# EAGLE design LNA-N (EAGLE 7.2.0)
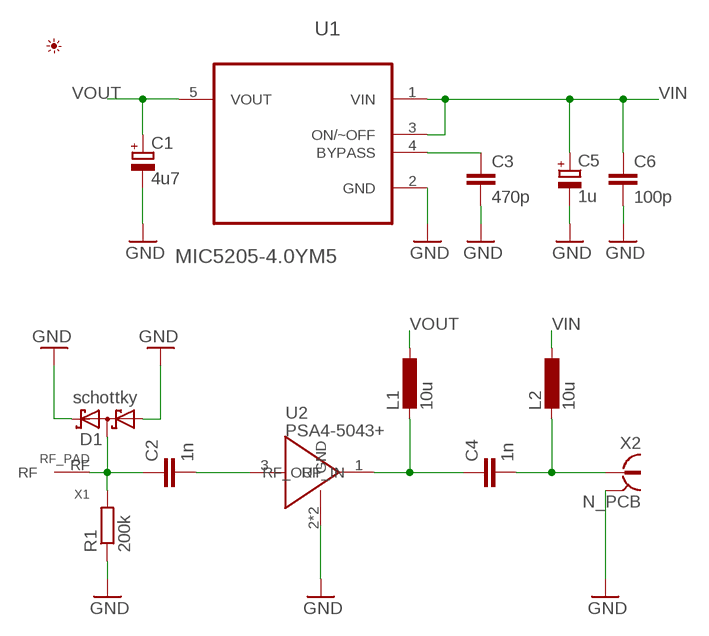
[diagram p0: schematic, sheet 1]

## Parts
C1  4u7  CPOL-EUSMCA  [SMC_A]
C2  1n  C-EUC0805  [C0805]
C3  470p  C-EUC0603  [C0603]
C4  1n  C-EUC0805  [C0805]
C5  1u  CPOL-EUSMCA  [SMC_A]
C6  100p  C-EUC0603  [C0603]
D1  schottky  BAS70-04  [SOT23]
L1  10u  L-EUL2012C  [L2012C]
L2  10u  L-EUL2012C  [L2012C]
R1  200k  R-EU_R0805  [R0805]
U1  MIC5205-4.0YM5  LP2985A-18DBVJ  [SOT95P280X145-5N]
U2  PSA4-5043+  [SOT343]
U$1  PICTO_1  [PICTO_1]
X1  RF_PAD  [RF_PAD]
X2  N_PCB  [N_PCB]

## Nets
GND: C1.- C3.2 C5.- C6.2 D1.1(A1) D1.2(C2) R1.1 U1.2(GND) U2.2(GND) U2.4(GND) X2.2 X2.3 X2.4 X2.5
N$1 [net]: C3.1 U1.4(BYPASS)
N$2 [RF]: C2.2 U2.3(RF_IN)
N$3 [RF]: C4.1 L1.2 U2.1(RF_OUT)
RF_IN [RF]: C2.1 D1.3(C1A2) R1.2 X1.RF
RF_OUT [RF]: C4.2 L2.2 X2.1
VIN [net]: C5.+ C6.1 L2.1 U1.1(VIN) U1.3(ON/~OFF)
VOUT [net]: C1.+ L1.1 U1.5(VOUT)

## Library data of the parts
C1 C5 = rcl:CPOL-EU: POLARIZED CAPACITOR, European symbol
C2-C4 C6 = rcl:C-EU: CAPACITOR, European symbol
D1 = diode:BAS70-04: Silicon Schottky Diodes General-purpose diode for high-speed switching
L1 L2 = rcl:L-EU: INDUCTOR, European symbol
R1 = rcl:R-EU_: RESISTOR, European symbol
U1 = Texas Instruments_By_element14_Batch_1:LP2985A-18DBVJ: 150-mA LOW-NOISE LOW-DROPOUT REGULATOR; MPN: LP2985A-18DBVJ; OC_FARNELL: 1924808; OC_NEWARK: 58T1987; PACKAGE: SOT-23-5; SUPPLIER: Texas Instruments
U2 = Mini-Circuits:PSA4-5043+: Mini-Circuits PSA4-5043+
U$1 = My_Picto:PICTO_1: Zdenek Brichacek; OK3ZB; http://blog.brichacek.net
X1 = RF coax:RF_PAD
X2 = RF coax:N_PCB: N Jack; OC_FARNELL: unknown; OC_NEWARK: unknown

## Net classes
1 RF: width 2.5 mm, clearance 0.508 mm
2 net: width 0.6 mm, clearance 0.254 mm

## Board
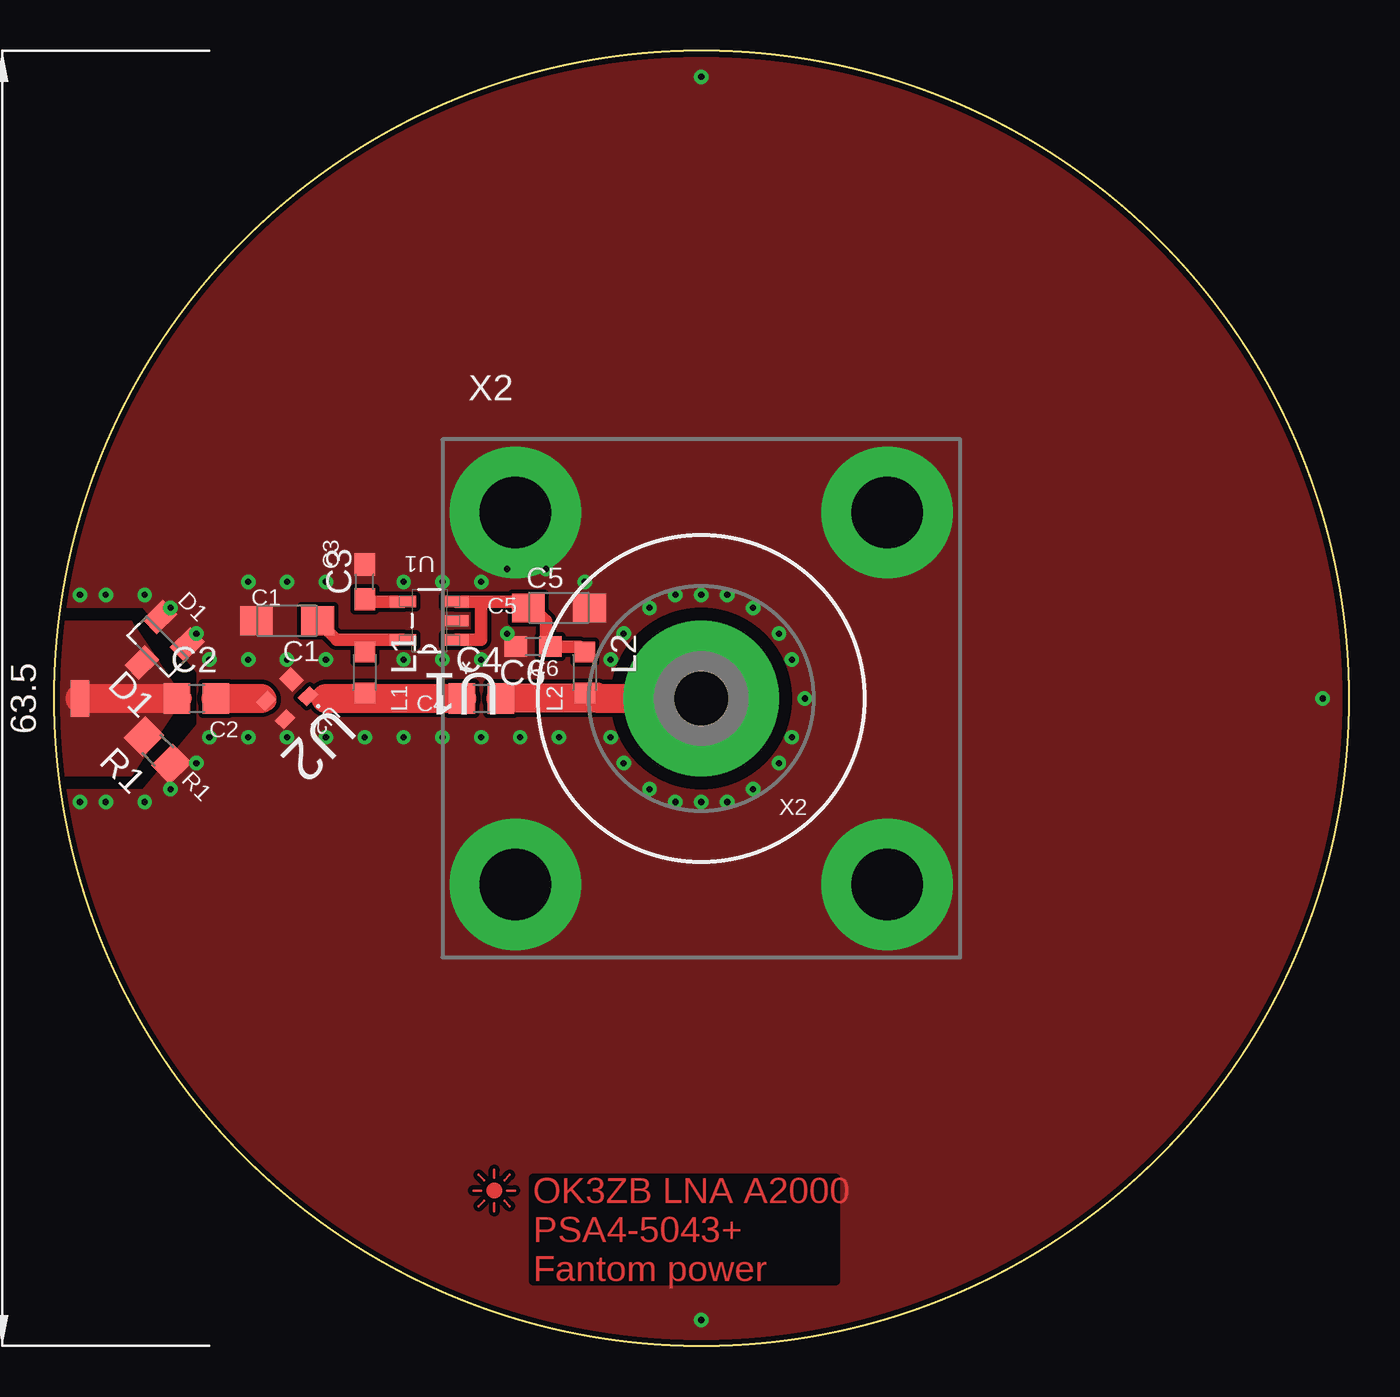
[diagram p1: board, top side]
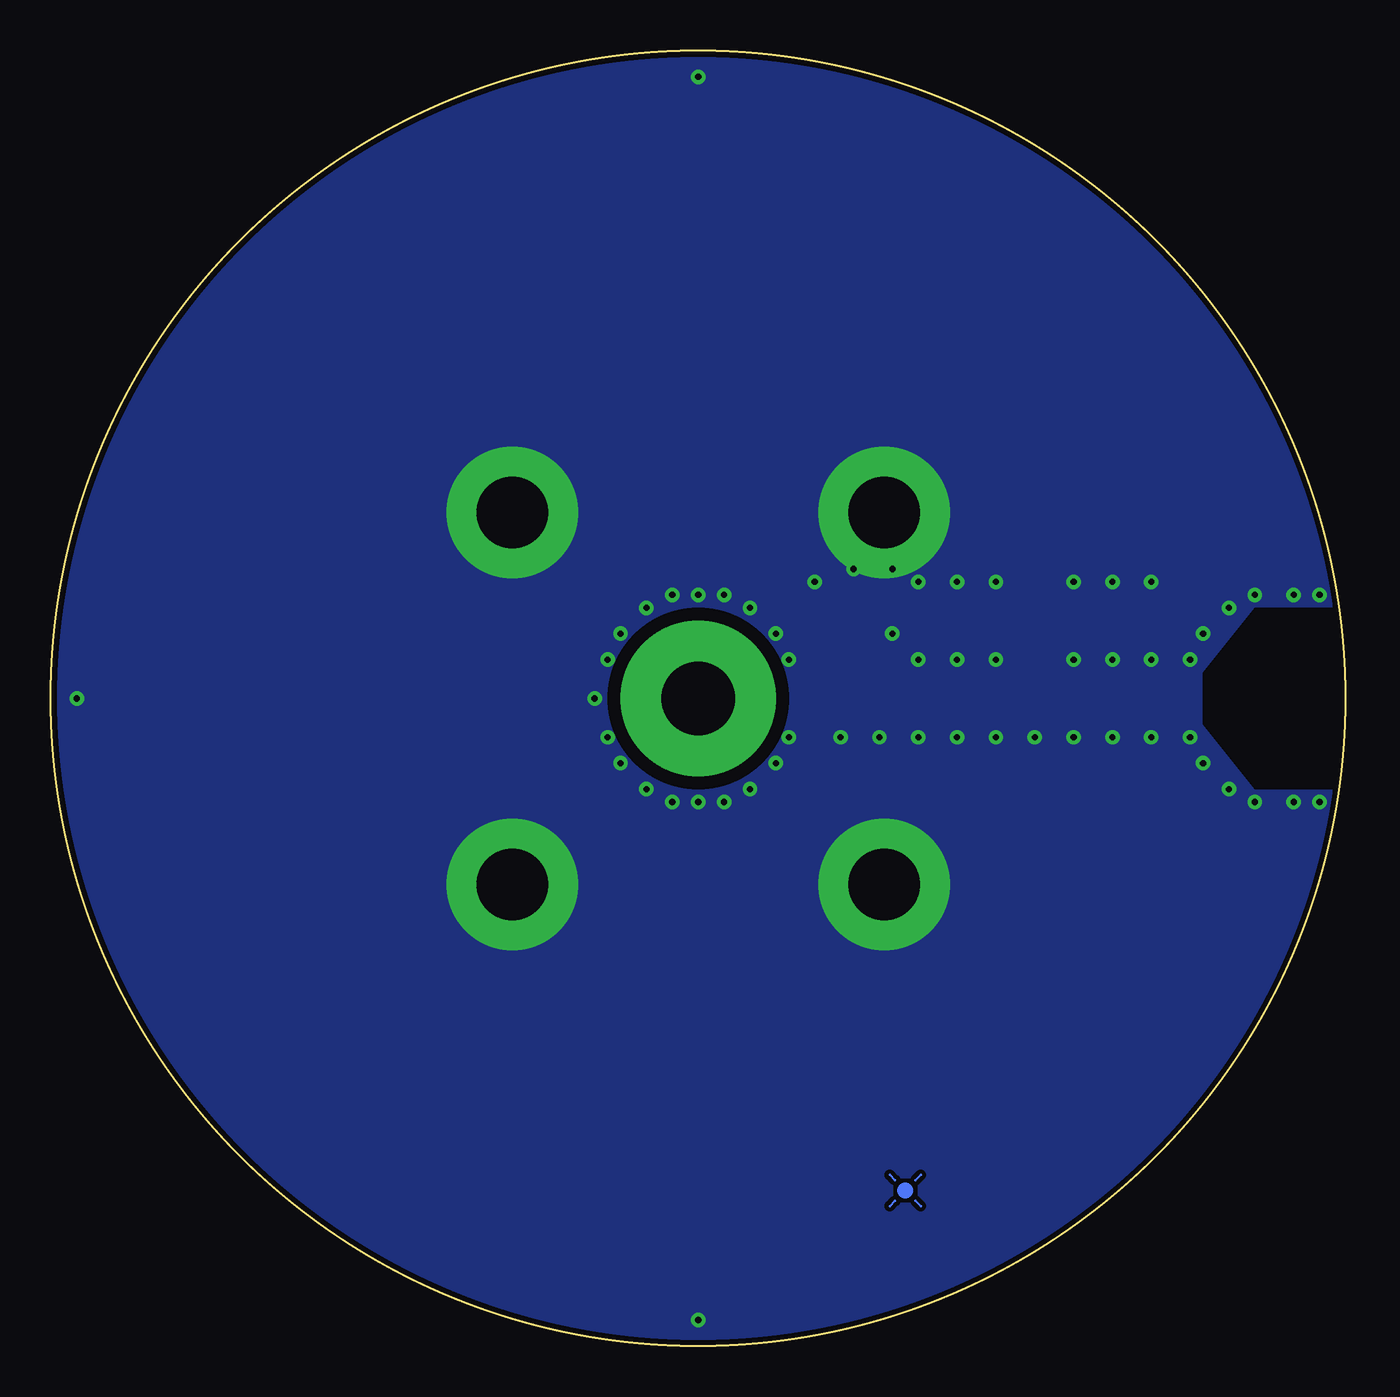
[diagram p2: board, bottom side, seen from below]

Size 63.5 x 63.5 mm. Coordinates in mm from the lower left corner, seen from the top.
Outline: circle at 31.75,31.75 radius 31.75
Copper layers (1*16): Top 0.035mm / dielectric 1.5mm / Bottom 0.035mm
Design rules "default *": minimum track width 10mil, minimum drill 24mil, track to track 8mil, track to pad 8mil, pad to pad 8mil, via to via 8mil, smd to smd 8mil, copper to edge 10mil, drill to drill 8mil, minimum pad ring 10mil, minimum via ring 8mil, stop-mask expansion 4mil, vias tented up to drill 0mil, thermal gap 0mil

### Footprints (pad centres in the part's own frame; a part is rotated, then mirrored left to right if it is on the bottom)
SMC_A = smd 1.6 x 1.4: + -1.5,0; - 1.5,0
C0805 = smd 1.3 x 1.5: 1 -0.95,0; 2 0.95,0
C0603 = smd 1.1 x 1: 1 -0.85,0; 2 0.85,0
SOT23 = smd 1 x 1.4: 1 -0.95,-1.1; 2 0.95,-1.1; 3 0,1.1
L2012C = smd 1 x 1: 1 -1,0; 2 1,0
R0805 = smd 1.3 x 1.5: 1 -0.95,0; 2 0.95,0
SOT95P280X145-5N = smd 1.27 x 0.559: 1 -1.295,0.94; 2 -1.295,0; 3 -1.295,-0.94; 4 1.295,-0.94; 5 1.295,0.94
SOT343 = smd 0.8 x 0.6: 1 -0.8,0.65; 3 0.8,-0.65; 4 0.8,0.65 | smd 0.8 x 0.9: 2 -0.8,-0.5
RF_PAD = smd 1.778 x 0.914: RF 0,0
N_PCB = drill 3.6 pad 7.62: 1 12.7,12.7 | drill 3.5 pad 6.452: 2 3.57,21.82; 3 21.82,21.82; 4 21.82,3.57; 5 3.57,3.57

### Placement (x,y rotation side)
C1  11.43,35.56 180 top
C2  6.98,31.75 0 top
C3  15.24,37.47 90 top
C4  20.95,31.75 0 top
C5  24.77,36.2 0 top
C6  23.49,34.29 180 top
D1  5.08,34.29 135 top
L1  15.24,33.02 270 top
L2  26.04,33.02 270 top
R1  5.08,29.21 135 top
U1  18.41,35.56 180 top
U2  11.43,31.75 225 top
U$1  21.59,7.62 0 top
X1  1.27,31.75 90 top
X2  19.05,19.05 0 top

### Tracks (layer width: path | path; a pad name or v marks a point on that pad's centre or on a via)
GND  (via drill 0.3)
  other vias: 1.27,36.83 17.14,33.66 19.05,33.66 20.95,33.66 27.3,33.66 29.21,36.2 13.34,33.66 11.43,33.66 9.52,33.66 7.62,33.66 7.62,29.84 9.52,29.84 11.43,29.84 13.34,29.84 15.24,29.84 17.14,29.84 19.05,29.84 20.95,29.84 22.86,29.84 24.77,29.84 27.3,29.84 29.21,27.3 30.48,26.67 31.75,26.67 33.02,26.67 34.29,27.3 30.48,36.83 31.75,36.83 33.02,36.83 34.29,36.2 36.2,33.66 36.83,31.75 36.2,29.84 35.56,28.57 6.98,34.92 4.45,36.83 2.54,36.83 1.27,26.67 2.54,26.67 4.45,26.67 5.71,27.3 6.98,28.57 35.56,34.92 9.52,37.47 11.43,37.47 13.34,37.47 17.14,37.47 19.05,37.47 20.95,37.47 26.04,37.47 24.13,38.1 22.23,38.1 22.23,34.92 27.94,34.92 27.94,28.57 5.71,36.2 62.23,31.75 31.75,62.23 31.75,1.27
  pour Bottom: 0,31.75 0,24.13 7.62,8.89 21.59,1.27 35.56,-1.27 53.34,6.35 64.77,24.13 62.23,45.72 48.26,60.96 27.94,64.77 10.16,57.15 0,40.64
  pour Top: 0,40.64 10.16,57.15 27.94,64.77 48.26,60.96 62.23,45.72 64.77,24.13 53.34,6.35 35.56,-1.27 21.59,1.27 7.62,8.89 0,24.13 0,27.3 6.98,27.3 6.98,36.2 0,36.2
  pour Top: 3.81,36.83 6.98,33.02 7.62,33.02 7.62,36.83
  pour Top: 3.81,26.67 6.98,30.48 7.62,30.48 7.62,26.67
N$1
  Top 0.61: C3.1 15.36,36.5 U1.4
N$2
  Top 1.016: 10.16,31.75 10.41,31.75 U2.3
  Top 1.422: C2.2 10.16,31.75
N$3
  Top 0.61: U2.1 13.34,31.86
  Top 1.016: 13.34,31.86 13.34,31.75 | L1.2 15.24,31.75
  Top 1.422: 13.34,31.75 15.24,31.75 C4.1
N$4
  cutout Bottom: 0,36.2 4.45,36.2 6.98,33.02 6.98,30.48 4.45,27.3 0,27.3
RF_IN
  Top 0.813: 5.71,31.75 6.35,31.75
  Top 1.422: X1.RF 5.71,31.75 C2.1
  pour Top: 0,35.56 3.81,35.56 6.35,31.75 3.81,27.94 0,27.94
RF_OUT
  Top 1.016: L2.2 26.67,32.02 26.67,31.75
  Top 1.422: C4.2 26.67,31.75 X2.1
VIN
  Top 0.61: U1.3 20.95,36.5 | 20.95,36.5 22.96,36.5 C5.+ 23.49,36.2 24.13,35.56 24.13,34.51 C6.1 25.77,34.29 L2.1 | U1.1 20.95,34.62 20.95,36.5
VOUT
  Top 0.61: U1.5 15.24,34.62 | L1.1 15.24,34.62 | C1.+ 13.87,34.62 15.24,34.62

### Text on the board
Top: OK3ZB LNA A2000 / PSA4-5043+ / Fantom power
_tNames: U1 | C3 | C1 | D1 | C5 | C6 | L1 | L2 | U2 | C4 | C2 | R1 | X2